# EAGLE schematic H-Bridge Motor Ctrl (EAGLE 7.5.0)
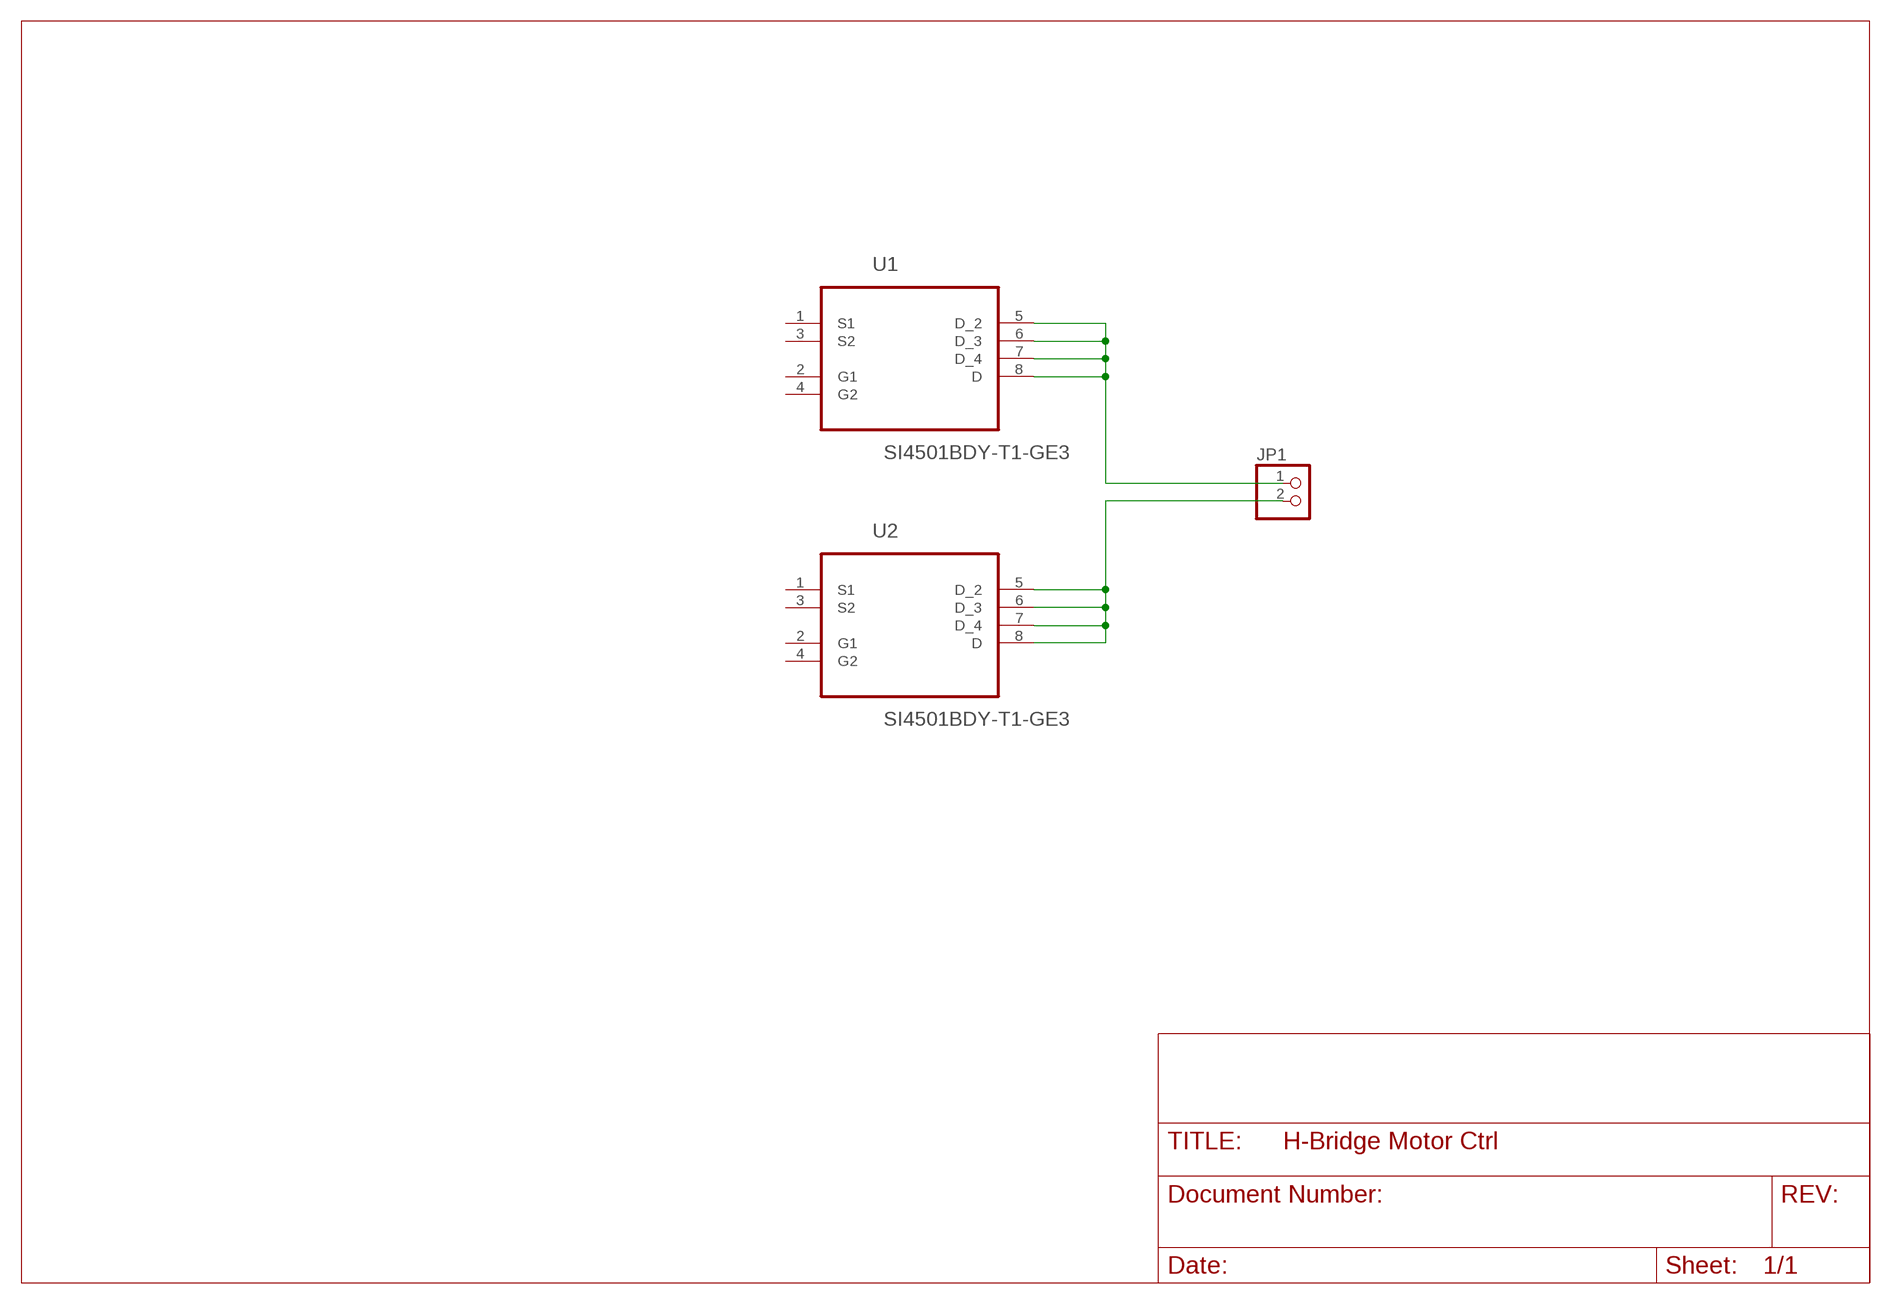
[diagram p0: schematic, sheet 1]

## Parts
JP1  PINHD-1X2  [1X02]
U1  SI4501BDY-T1-GE3  [SOIC127P600X175-8N]
U2  SI4501BDY-T1-GE3  [SOIC127P600X175-8N]

## Nets
N$1: JP1.1 U1.5(D_2) U1.6(D_3) U1.7(D_4) U1.8(D)
N$2: JP1.2 U2.5(D_2) U2.6(D_3) U2.7(D_4) U2.8(D)
Unconnected: U1.1(S1) U1.2(G1) U1.3(S2) U1.4(G2) U2.1(S1) U2.2(G1) U2.3(S2) U2.4(G2)

## Library data of the parts
JP1 = pinhead:PINHD-1X2: PIN HEADER
U1 U2 = SI4501BDY-T1-GE3:SI4501BDY-T1-GE3: MOSFET; MPN: SI4501BDY-T1-GE3; OC_FARNELL: 2056722; OC_NEWARK: 64T4068; PACKAGE: SOIC-8; SUPPLIER: VISHAY SILICONIX